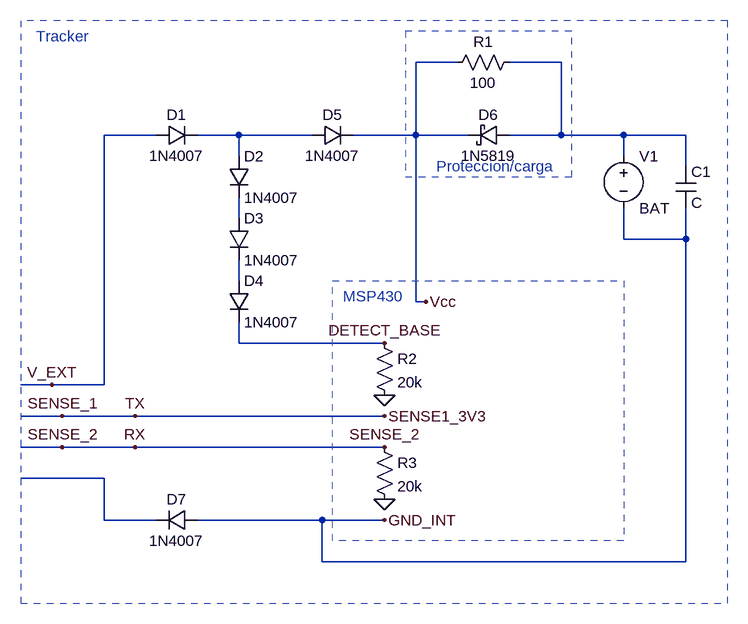
[diagram p0: schematic Schem_tracker.asc]
Schem_tracker.asc, the LTspice schematic file:
Version 4
SHEET 1 880 680
WIRE 432 -208 368 -208
WIRE 592 -208 512 -208
WIRE -32 -96 -112 -96
WIRE 96 -96 32 -96
WIRE 208 -96 96 -96
WIRE 368 -96 368 -208
WIRE 368 -96 272 -96
WIRE 448 -96 368 -96
WIRE 592 -96 592 -208
WIRE 592 -96 512 -96
WIRE 688 -96 592 -96
WIRE 784 -96 688 -96
WIRE 96 -64 96 -96
WIRE 688 -64 688 -96
WIRE 784 -48 784 -96
WIRE 96 32 96 0
WIRE 688 64 688 16
WIRE 784 64 784 16
WIRE 784 64 688 64
WIRE 96 128 96 96
WIRE 368 160 368 -96
WIRE 384 160 368 160
WIRE 96 224 96 192
WIRE 320 224 96 224
WIRE -192 288 -240 288
WIRE -112 288 -112 -96
WIRE -112 288 -192 288
WIRE -176 336 -240 336
WIRE -64 336 -176 336
WIRE 320 336 -64 336
WIRE -176 384 -240 384
WIRE -64 384 -176 384
WIRE 320 384 -64 384
WIRE -112 432 -240 432
WIRE -112 496 -112 432
WIRE -32 496 -112 496
WIRE 224 496 32 496
WIRE 320 496 224 496
WIRE 224 560 224 496
WIRE 784 560 784 64
WIRE 784 560 224 560
FLAG 320 224 DETECT_BASE
FLAG 320 304 0
FLAG 384 160 Vcc
FLAG 320 336 SENSE1_3V3
FLAG 320 464 0
FLAG 320 496 GND_INT
FLAG 320 384 SENSE_2
FLAG -192 288 V_EXT
FLAG -176 336 SENSE_1
FLAG -176 384 SENSE_2
FLAG -64 336 TX
FLAG -64 384 RX
SYMBOL diode -32 -80 R270
WINDOW 0 32 32 VTop 2
WINDOW 3 0 32 VBottom 2
SYMATTR InstName D1
SYMATTR Value 1N4007
SYMBOL diode 80 -64 R0
SYMATTR InstName D2
SYMATTR Value 1N4007
SYMBOL diode 80 32 R0
SYMATTR InstName D3
SYMATTR Value 1N4007
SYMBOL diode 80 128 R0
SYMATTR InstName D4
SYMATTR Value 1N4007
SYMBOL diode 208 -80 R270
WINDOW 0 32 32 VTop 2
WINDOW 3 0 32 VBottom 2
SYMATTR InstName D5
SYMATTR Value 1N4007
SYMBOL schottky 512 -112 R90
WINDOW 0 0 32 VBottom 2
WINDOW 3 32 32 VTop 2
SYMATTR InstName D6
SYMATTR Value 1N5819
SYMBOL res 528 -224 R90
WINDOW 0 0 56 VBottom 2
WINDOW 3 32 56 VTop 2
SYMATTR InstName R1
SYMATTR Value 100
SYMBOL voltage 688 -80 R0
SYMATTR InstName V1
SYMATTR Value BAT
SYMBOL cap 768 -48 R0
SYMATTR InstName C1
SYMBOL res 304 208 R0
SYMATTR InstName R2
SYMATTR Value 20k
SYMBOL res 304 368 R0
SYMATTR InstName R3
SYMATTR Value 20k
SYMBOL diode 32 480 R90
WINDOW 0 0 32 VBottom 2
WINDOW 3 32 32 VTop 2
SYMATTR InstName D7
SYMATTR Value 1N4007
TEXT 256 152 Left 2 ;MSP430
TEXT -216 -248 Left 2 ;Tracker
TEXT 400 -48 Left 2 ;Proteccion/carga
RECTANGLE Normal 688 528 240 128 2
RECTANGLE Normal 848 -272 -240 624 2
RECTANGLE Normal 608 -256 352 -32 2

The netlist it stands for:
* Schem_tracker.asc
D1 V_EXT N002 1N4007
D2 N002 N003 1N4007
D3 N003 N004 1N4007
D4 N004 DETECT_BASE 1N4007
D5 N002 Vcc 1N4007
D6 N001 Vcc 1N5819
R1 N001 Vcc 100
V1 N001 GND_INT BAT
C1 N001 GND_INT C
R2 DETECT_BASE 0 20k
R3 RX 0 20k
D7 GND_INT N005 1N4007
.model D D
.lib standard.dio
* MSP430
* Tracker
* Proteccion/carga
.backanno
.end